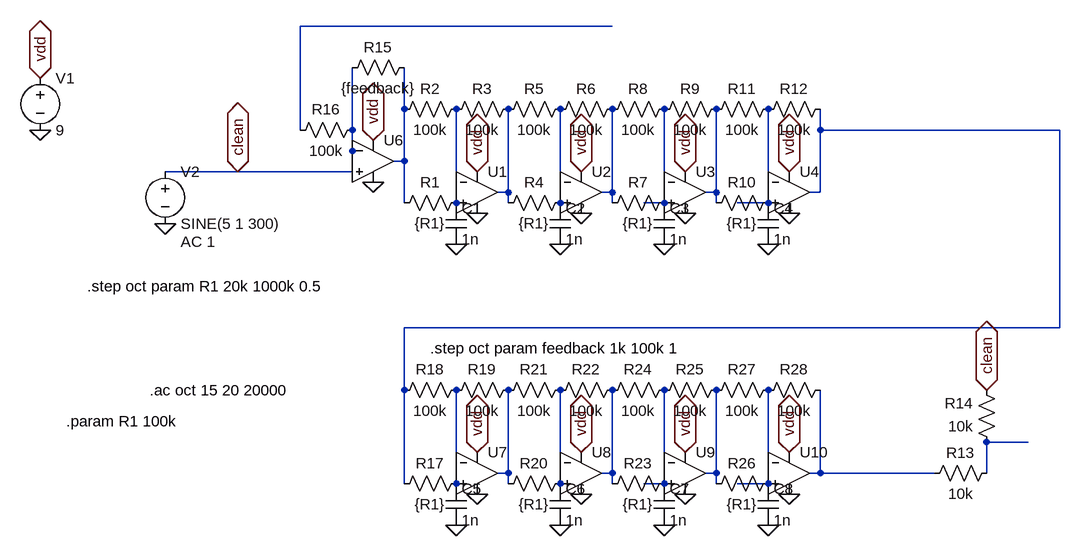
[diagram p0: schematic LDR_Phaser_simplified.asc]
LDR_Phaser_simplified.asc, the LTspice schematic file:
Version 4
SHEET 1 996 740
WIRE 304 -112 -176 -112
WIRE -16 16 -16 -48
WIRE -176 48 -176 -112
WIRE -96 48 -96 -48
WIRE 624 48 624 16
WIRE 992 48 624 48
WIRE -96 80 -96 48
WIRE -96 96 -96 80
WIRE -16 96 -16 16
WIRE -16 96 -32 96
WIRE -272 112 -384 112
WIRE -96 112 -272 112
WIRE 64 128 64 16
WIRE 224 128 224 16
WIRE 384 128 384 16
WIRE 544 128 544 16
WIRE 144 144 144 16
WIRE 144 144 128 144
WIRE 304 144 304 16
WIRE 304 144 288 144
WIRE 464 144 464 16
WIRE 464 144 448 144
WIRE 624 144 624 48
WIRE 624 144 608 144
WIRE -16 160 -16 96
WIRE 144 160 144 144
WIRE 240 160 224 160
WIRE 304 160 304 144
WIRE 384 160 352 160
WIRE 464 160 464 144
WIRE 544 160 496 160
WIRE 992 352 992 48
WIRE 992 352 -16 352
WIRE -16 448 -16 352
WIRE 944 528 880 528
WIRE 64 560 64 448
WIRE 224 560 224 448
WIRE 384 560 384 448
WIRE 544 560 544 448
WIRE 144 576 144 448
WIRE 144 576 128 576
WIRE 304 576 304 448
WIRE 304 576 288 576
WIRE 464 576 464 448
WIRE 464 576 448 576
WIRE 624 576 624 448
WIRE 624 576 608 576
WIRE 800 576 624 576
WIRE 880 576 880 528
WIRE -16 592 -16 448
WIRE 144 592 144 576
WIRE 240 592 224 592
WIRE 304 592 304 576
WIRE 384 592 352 592
WIRE 464 592 464 576
WIRE 544 592 496 592
FLAG 96 176 0
FLAG -576 48 0
FLAG -384 192 0
FLAG -576 -32 vdd
IOPIN -576 -32 BiDir
FLAG 96 112 vdd
IOPIN 96 112 BiDir
FLAG 256 176 0
FLAG 256 112 vdd
IOPIN 256 112 BiDir
FLAG 416 176 0
FLAG 384 224 0
FLAG 416 112 vdd
IOPIN 416 112 BiDir
FLAG 576 176 0
FLAG 544 224 0
FLAG 576 112 vdd
IOPIN 576 112 BiDir
FLAG 64 224 0
FLAG 224 224 0
FLAG -64 128 0
FLAG -64 64 vdd
IOPIN -64 64 BiDir
FLAG 96 608 0
FLAG 96 544 vdd
IOPIN 96 544 BiDir
FLAG 256 608 0
FLAG 256 544 vdd
IOPIN 256 544 BiDir
FLAG 416 608 0
FLAG 384 656 0
FLAG 416 544 vdd
IOPIN 416 544 BiDir
FLAG 576 608 0
FLAG 544 656 0
FLAG 576 544 vdd
IOPIN 576 544 BiDir
FLAG 64 656 0
FLAG 224 656 0
FLAG 880 448 clean
IOPIN 880 448 BiDir
FLAG -272 112 clean
IOPIN -272 112 BiDir
SYMBOL Opamps\\UniversalOpamp2 96 144 R0
SYMATTR InstName U1
SYMBOL voltage -576 -48 R0
WINDOW 123 0 0 Left 0
WINDOW 39 0 0 Left 0
SYMATTR InstName V1
SYMATTR Value 9
SYMBOL voltage -384 96 R0
WINDOW 123 24 124 Left 2
WINDOW 39 0 0 Left 0
SYMATTR InstName V2
SYMATTR Value SINE(5 1 300)
SYMATTR Value2 AC 1
SYMBOL cap 48 160 R0
SYMATTR InstName C1
SYMATTR Value 1n
SYMBOL res 80 144 R90
WINDOW 0 0 56 VBottom 2
WINDOW 3 32 56 VTop 2
SYMATTR InstName R1
SYMATTR Value {R1}
SYMBOL res 80 0 R90
WINDOW 0 0 56 VBottom 2
WINDOW 3 32 56 VTop 2
SYMATTR InstName R2
SYMATTR Value 100k
SYMBOL res 160 0 R90
WINDOW 0 0 56 VBottom 2
WINDOW 3 32 56 VTop 2
SYMATTR InstName R3
SYMATTR Value 100k
SYMBOL Opamps\\UniversalOpamp2 256 144 R0
SYMATTR InstName U2
SYMBOL cap 208 160 R0
SYMATTR InstName C2
SYMATTR Value 1n
SYMBOL res 240 144 R90
WINDOW 0 0 56 VBottom 2
WINDOW 3 32 56 VTop 2
SYMATTR InstName R4
SYMATTR Value {R1}
SYMBOL res 240 0 R90
WINDOW 0 0 56 VBottom 2
WINDOW 3 32 56 VTop 2
SYMATTR InstName R5
SYMATTR Value 100k
SYMBOL res 320 0 R90
WINDOW 0 0 56 VBottom 2
WINDOW 3 32 56 VTop 2
SYMATTR InstName R6
SYMATTR Value 100k
SYMBOL Opamps\\UniversalOpamp2 416 144 R0
SYMATTR InstName U3
SYMBOL cap 368 160 R0
SYMATTR InstName C3
SYMATTR Value 1n
SYMBOL res 400 144 R90
WINDOW 0 0 56 VBottom 2
WINDOW 3 32 56 VTop 2
SYMATTR InstName R7
SYMATTR Value {R1}
SYMBOL res 400 0 R90
WINDOW 0 0 56 VBottom 2
WINDOW 3 32 56 VTop 2
SYMATTR InstName R8
SYMATTR Value 100k
SYMBOL res 480 0 R90
WINDOW 0 0 56 VBottom 2
WINDOW 3 32 56 VTop 2
SYMATTR InstName R9
SYMATTR Value 100k
SYMBOL Opamps\\UniversalOpamp2 576 144 R0
SYMATTR InstName U4
SYMBOL cap 528 160 R0
SYMATTR InstName C4
SYMATTR Value 1n
SYMBOL res 560 144 R90
WINDOW 0 0 56 VBottom 2
WINDOW 3 32 56 VTop 2
SYMATTR InstName R10
SYMATTR Value {R1}
SYMBOL res 560 0 R90
WINDOW 0 0 56 VBottom 2
WINDOW 3 32 56 VTop 2
SYMATTR InstName R11
SYMATTR Value 100k
SYMBOL res 640 0 R90
WINDOW 0 0 56 VBottom 2
WINDOW 3 32 56 VTop 2
SYMATTR InstName R12
SYMATTR Value 100k
SYMBOL res -80 32 R90
WINDOW 0 0 56 VBottom 2
WINDOW 3 32 56 VTop 2
SYMATTR InstName R16
SYMATTR Value 100k
SYMBOL Opamps\\UniversalOpamp2 -64 96 R0
SYMATTR InstName U6
SYMBOL res 0 -64 R90
WINDOW 0 0 56 VBottom 2
WINDOW 3 32 56 VTop 2
SYMATTR InstName R15
SYMATTR Value {feedback}
SYMBOL Opamps\\UniversalOpamp2 96 576 R0
SYMATTR InstName U7
SYMBOL cap 48 592 R0
SYMATTR InstName C5
SYMATTR Value 1n
SYMBOL res 80 576 R90
WINDOW 0 0 56 VBottom 2
WINDOW 3 32 56 VTop 2
SYMATTR InstName R17
SYMATTR Value {R1}
SYMBOL res 80 432 R90
WINDOW 0 0 56 VBottom 2
WINDOW 3 32 56 VTop 2
SYMATTR InstName R18
SYMATTR Value 100k
SYMBOL res 160 432 R90
WINDOW 0 0 56 VBottom 2
WINDOW 3 32 56 VTop 2
SYMATTR InstName R19
SYMATTR Value 100k
SYMBOL Opamps\\UniversalOpamp2 256 576 R0
SYMATTR InstName U8
SYMBOL cap 208 592 R0
SYMATTR InstName C6
SYMATTR Value 1n
SYMBOL res 240 576 R90
WINDOW 0 0 56 VBottom 2
WINDOW 3 32 56 VTop 2
SYMATTR InstName R20
SYMATTR Value {R1}
SYMBOL res 240 432 R90
WINDOW 0 0 56 VBottom 2
WINDOW 3 32 56 VTop 2
SYMATTR InstName R21
SYMATTR Value 100k
SYMBOL res 320 432 R90
WINDOW 0 0 56 VBottom 2
WINDOW 3 32 56 VTop 2
SYMATTR InstName R22
SYMATTR Value 100k
SYMBOL Opamps\\UniversalOpamp2 416 576 R0
SYMATTR InstName U9
SYMBOL cap 368 592 R0
SYMATTR InstName C7
SYMATTR Value 1n
SYMBOL res 400 576 R90
WINDOW 0 0 56 VBottom 2
WINDOW 3 32 56 VTop 2
SYMATTR InstName R23
SYMATTR Value {R1}
SYMBOL res 400 432 R90
WINDOW 0 0 56 VBottom 2
WINDOW 3 32 56 VTop 2
SYMATTR InstName R24
SYMATTR Value 100k
SYMBOL res 480 432 R90
WINDOW 0 0 56 VBottom 2
WINDOW 3 32 56 VTop 2
SYMATTR InstName R25
SYMATTR Value 100k
SYMBOL Opamps\\UniversalOpamp2 576 576 R0
SYMATTR InstName U10
SYMBOL cap 528 592 R0
SYMATTR InstName C8
SYMATTR Value 1n
SYMBOL res 560 576 R90
WINDOW 0 0 56 VBottom 2
WINDOW 3 32 56 VTop 2
SYMATTR InstName R26
SYMATTR Value {R1}
SYMBOL res 560 432 R90
WINDOW 0 0 56 VBottom 2
WINDOW 3 32 56 VTop 2
SYMATTR InstName R27
SYMATTR Value 100k
SYMBOL res 640 432 R90
WINDOW 0 0 56 VBottom 2
WINDOW 3 32 56 VTop 2
SYMATTR InstName R28
SYMATTR Value 100k
SYMBOL res 896 560 R90
WINDOW 0 0 56 VBottom 2
WINDOW 3 32 56 VTop 2
SYMATTR InstName R13
SYMATTR Value 10k
SYMBOL res 896 544 R180
WINDOW 0 36 76 Left 2
WINDOW 3 36 40 Left 2
SYMATTR InstName R14
SYMATTR Value 10k
TEXT -504 288 Left 2 !.step oct param R1 20k 1000k 0.5
TEXT -408 448 Left 2 !.ac oct 15 20 20000
TEXT -536 496 Left 2 !.param R1 100k
TEXT 24 384 Left 2 !.step oct param feedback 1k 100k 1

The netlist it stands for:
* LDR_Phaser_simplified.asc
XU1 P001 N005 vdd 0 N009 level.2 Avol=1Meg GBW=10Meg Slew=10Meg ilimit=25m rail=0 Vos=0 phimargin=45 en=0 enk=0 in=0 ink=0 Rin=500Meg  ; pins IN+ IN- V+ V- OUT
V1 vdd 0 9
V2 clean 0 SINE(5 1 300) AC 1
C1 P001 0 1n
R1 P001 N002 {R1}
R2 N005 N002 100k
R3 N009 N005 100k
XU2 N012 N006 vdd 0 N010 level.2 Avol=1Meg GBW=10Meg Slew=10Meg ilimit=25m rail=0 Vos=0 phimargin=45 en=0 enk=0 in=0 ink=0 Rin=500Meg  ; pins IN+ IN- V+ V- OUT
C2 N012 0 1n
R4 N012 N009 {R1}
R5 N006 N009 100k
R6 N010 N006 100k
XU3 N013 N007 vdd 0 N011 level.2 Avol=1Meg GBW=10Meg Slew=10Meg ilimit=25m rail=0 Vos=0 phimargin=45 en=0 enk=0 in=0 ink=0 Rin=500Meg  ; pins IN+ IN- V+ V- OUT
C3 N013 0 1n
R7 N013 N010 {R1}
R8 N007 N010 100k
R9 N011 N007 100k
XU4 N014 N008 vdd 0 N004 level.2 Avol=1Meg GBW=10Meg Slew=10Meg ilimit=25m rail=0 Vos=0 phimargin=45 en=0 enk=0 in=0 ink=0 Rin=500Meg  ; pins IN+ IN- V+ V- OUT
C4 N014 0 1n
R10 N014 N011 {R1}
R11 N008 N011 100k
R12 N004 N008 100k
R16 N003 N001 100k
XU6 clean N003 vdd 0 N002 level.2 Avol=1Meg GBW=10Meg Slew=10Meg ilimit=25m rail=0 Vos=0 phimargin=45 en=0 enk=0 in=0 ink=0 Rin=500Meg  ; pins IN+ IN- V+ V- OUT
R15 N002 N003 {feedback}
XU7 P002 N016 vdd 0 N020 level.2 Avol=1Meg GBW=10Meg Slew=10Meg ilimit=25m rail=0 Vos=0 phimargin=45 en=0 enk=0 in=0 ink=0 Rin=500Meg  ; pins IN+ IN- V+ V- OUT
C5 P002 0 1n
R17 P002 N004 {R1}
R18 N016 N004 100k
R19 N020 N016 100k
XU8 N024 N017 vdd 0 N021 level.2 Avol=1Meg GBW=10Meg Slew=10Meg ilimit=25m rail=0 Vos=0 phimargin=45 en=0 enk=0 in=0 ink=0 Rin=500Meg  ; pins IN+ IN- V+ V- OUT
C6 N024 0 1n
R20 N024 N020 {R1}
R21 N017 N020 100k
R22 N021 N017 100k
XU9 N025 N018 vdd 0 N022 level.2 Avol=1Meg GBW=10Meg Slew=10Meg ilimit=25m rail=0 Vos=0 phimargin=45 en=0 enk=0 in=0 ink=0 Rin=500Meg  ; pins IN+ IN- V+ V- OUT
C7 N025 0 1n
R23 N025 N021 {R1}
R24 N018 N021 100k
R25 N022 N018 100k
XU10 N026 N019 vdd 0 N023 level.2 Avol=1Meg GBW=10Meg Slew=10Meg ilimit=25m rail=0 Vos=0 phimargin=45 en=0 enk=0 in=0 ink=0 Rin=500Meg  ; pins IN+ IN- V+ V- OUT
C8 N026 0 1n
R26 N026 N022 {R1}
R27 N019 N022 100k
R28 N023 N019 100k
R13 N015 N023 10k
R14 N015 clean 10k
.step oct param R1 20k 1000k 0.5
.ac oct 15 20 20000
.param R1 100k
.step oct param feedback 1k 100k 1
.lib UniversalOpamps2.sub
.backanno
.end